# EAGLE design electric-imp-breakout-r1 (EAGLE 5.12)
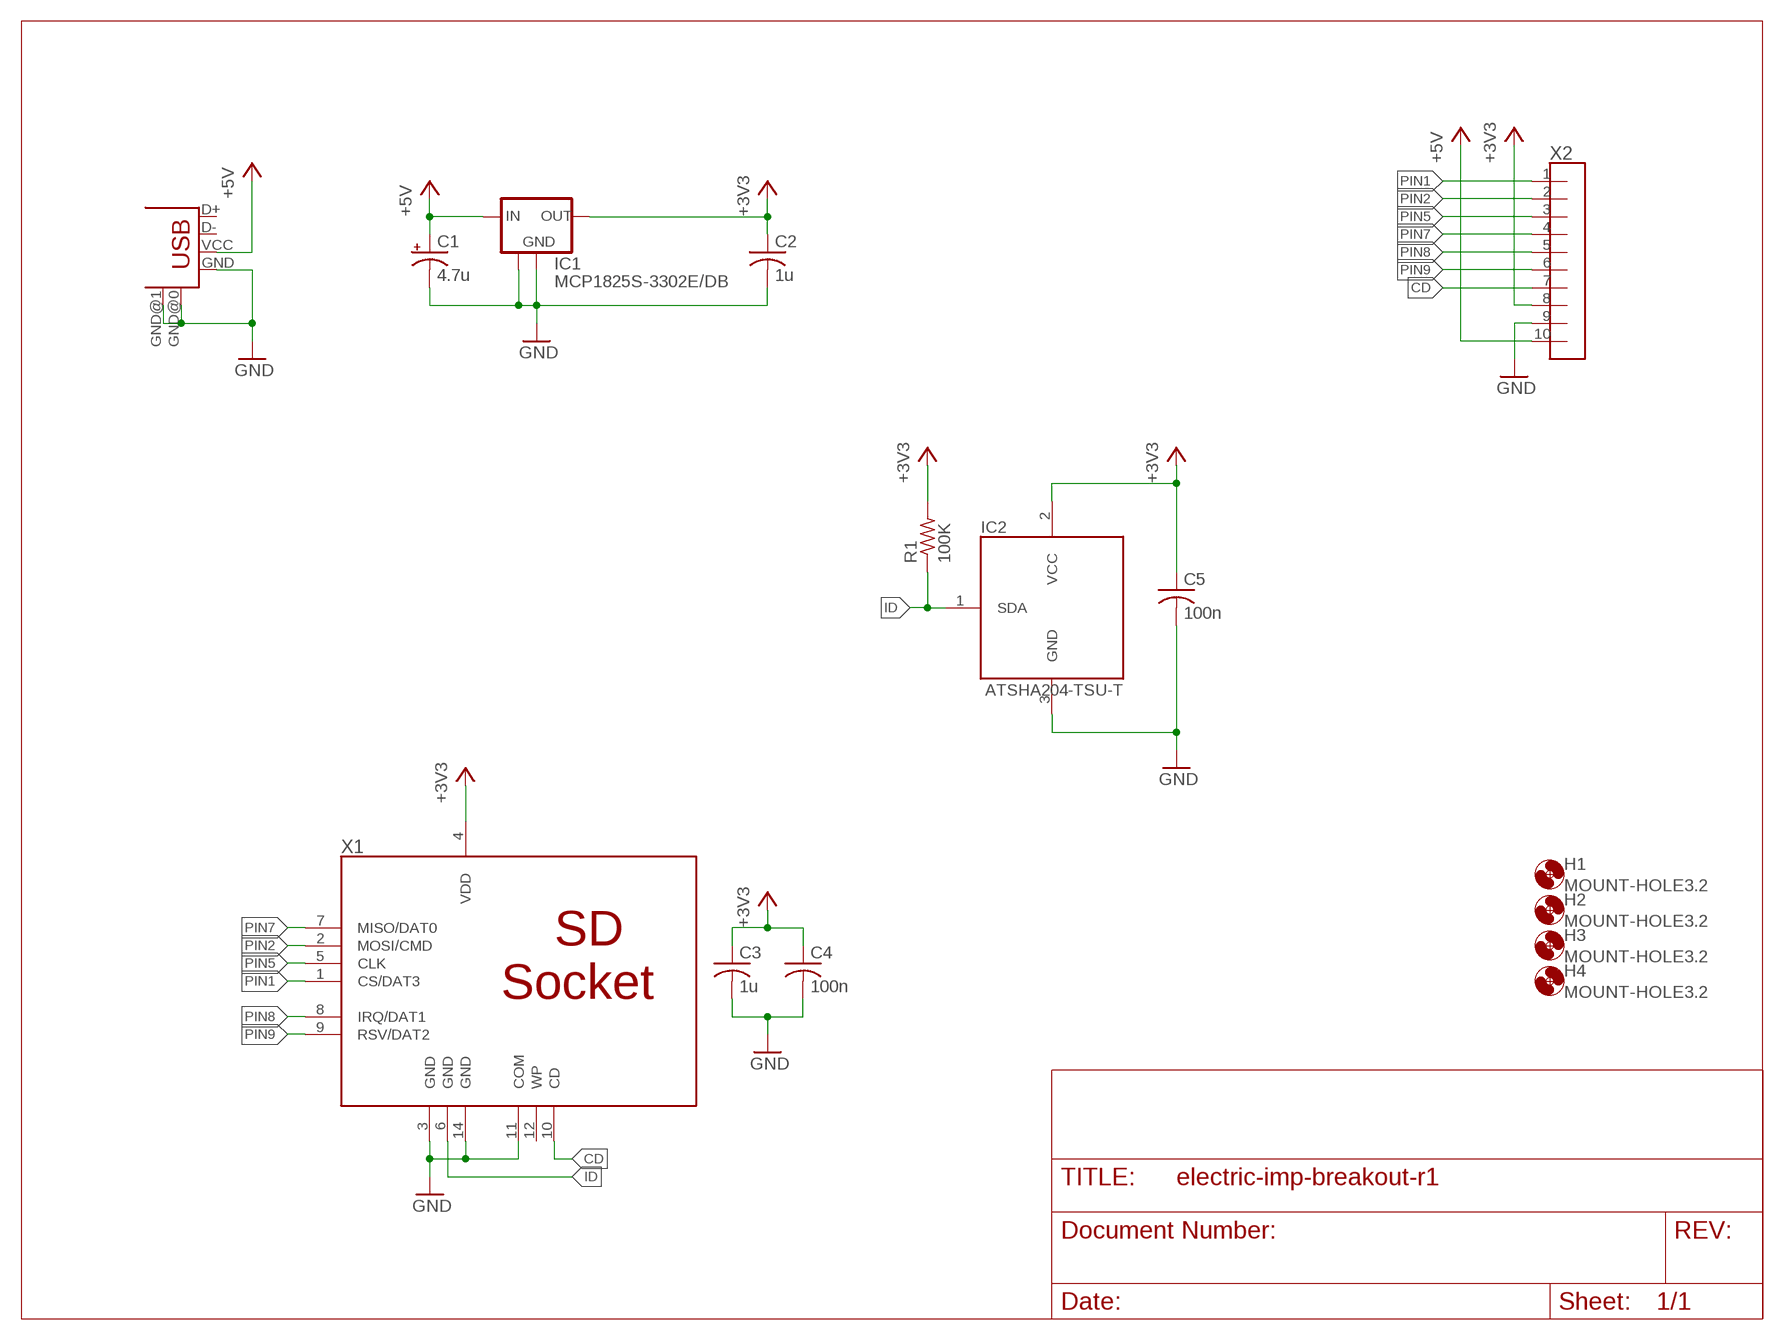
[diagram p0: schematic, sheet 1]

## Parts
C1  4.7u  CPOL-USB  [PANASONIC_B]
C2  1u  C-USC0603  [C0603]
C3  1u  C-USC0603  [C0603]
C4  100n  C-USC0603  [C0603]
C5  100n  C-USC0603  [C0603]
H1  MOUNT-HOLE3.2  [3,2]
H2  MOUNT-HOLE3.2  [3,2]
H3  MOUNT-HOLE3.2  [3,2]
H4  MOUNT-HOLE3.2  [3,2]
IC1  MCP1825S-3302E/DB  [SOT223]
IC2  ATSHA204-TSU-T  [SOT23]
R1  100K  R-US_R0603  [R0603]
USB1  USB-U  [USB-MICROB-ALI]
X1  SCDA1A090X  [SCDA1A090X]
X2  M10-100MIL  [100MIL-10]

## Nets
+3V3: C2.1 C3.1 C4.1 C5.1 IC1.3(OUT) IC2.2(VCC) R1.2 X1.4(VDD) X2.8
+5V: C1.+ IC1.1(IN) USB1.VCC(VBUS) X2.10
CD: X1.10(CD) X2.7
GND: C1.- C2.2 C3.2 C4.2 C5.2 IC1.2(GND) IC1.4(GND1) IC2.3(GND) USB1.GND USB1.GND@0(GND) USB1.GND@1(GND) X1.3(GND) X1.11(COM) X1.14(GND) X2.9
ID: IC2.1(SDA) R1.1 X1.6(GND)
PIN1: X1.1(CS/DAT3) X2.1
PIN2: X1.2(MOSI/CMD) X2.2
PIN5: X1.5(CLK) X2.3
PIN7: X1.7(MISO/DAT0) X2.4
PIN8: X1.8(IRQ/DAT1) X2.5
PIN9: X1.9(RSV/DAT2) X2.6
Unconnected: USB1.D+ USB1.D- X1.12(WP)

## Library data of the parts
C1 = rcl:CPOL-US: POLARIZED CAPACITOR, American symbol
C2-C5 = rcl:C-US: CAPACITOR, American symbol
H1-H4 = holes:MOUNT-HOLE: MOUNTING HOLE with drill center marker
IC1 = rbg-microchip-vreg:MCP1825S-3302E
IC2 = rbg-atmel-cryptoauth:ATSHA204-TSU-T
R1 = rcl:R-US_: RESISTOR, American symbol
USB1 = con-usb-2:USB: USB Connectors
X1 = rbg-alps-sd:SCDA1A090X
X2 = rbg-generic-headers:M10-100MIL

## Board
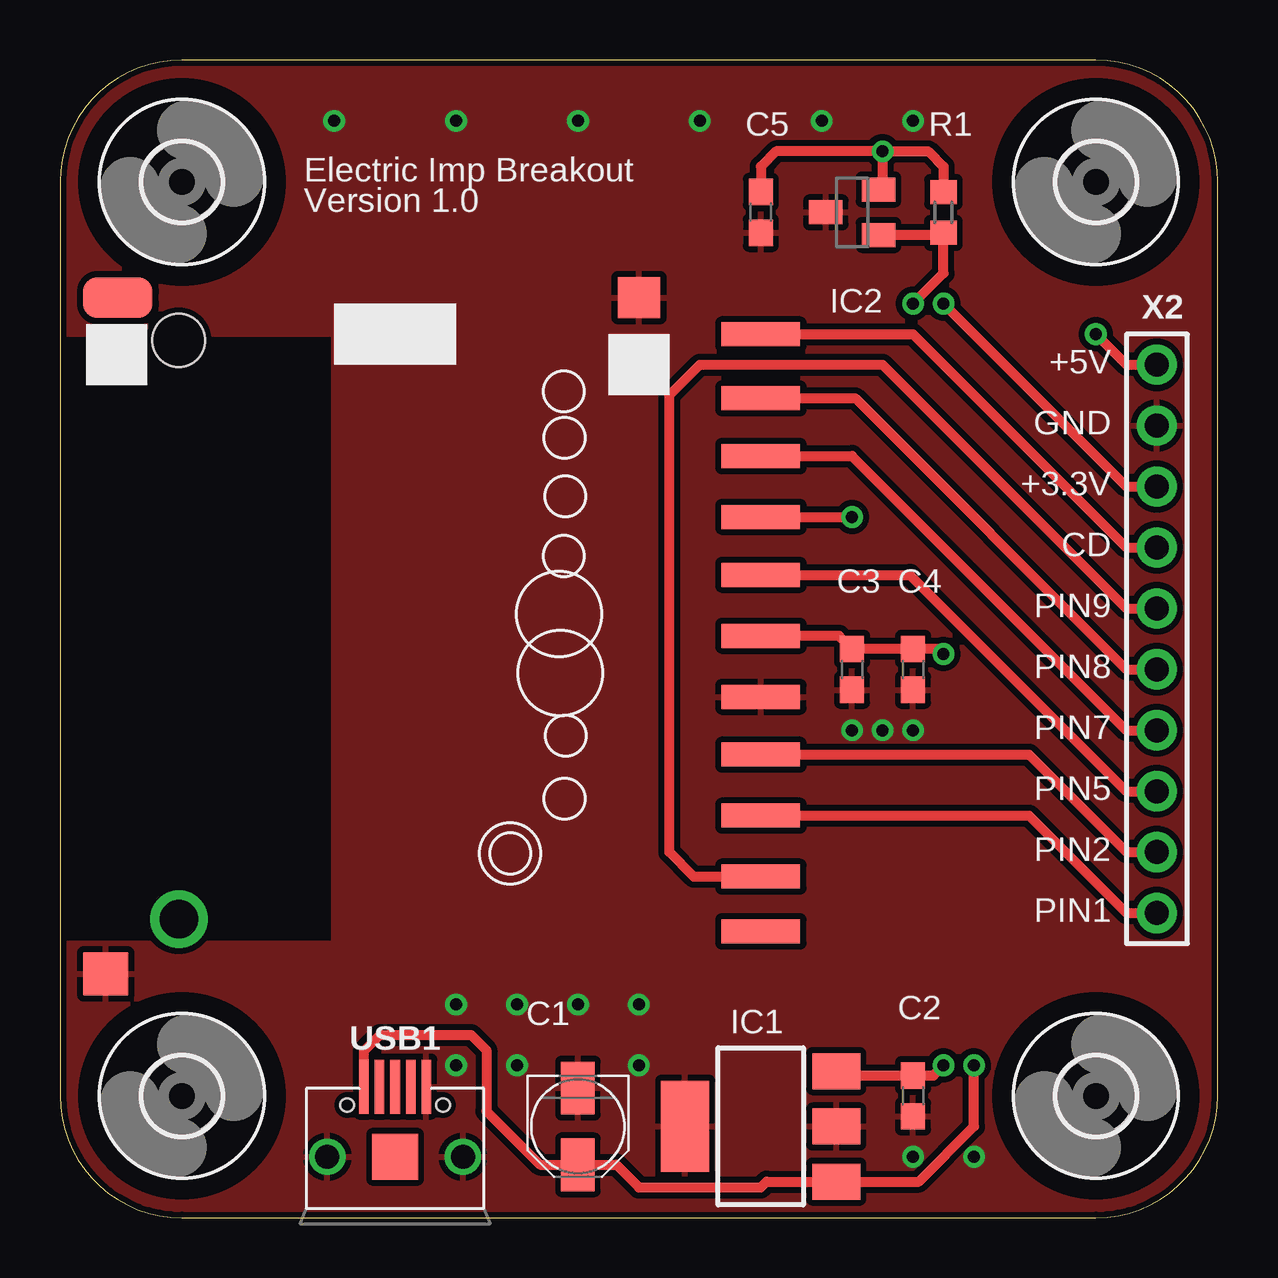
[diagram p1: board, top side]
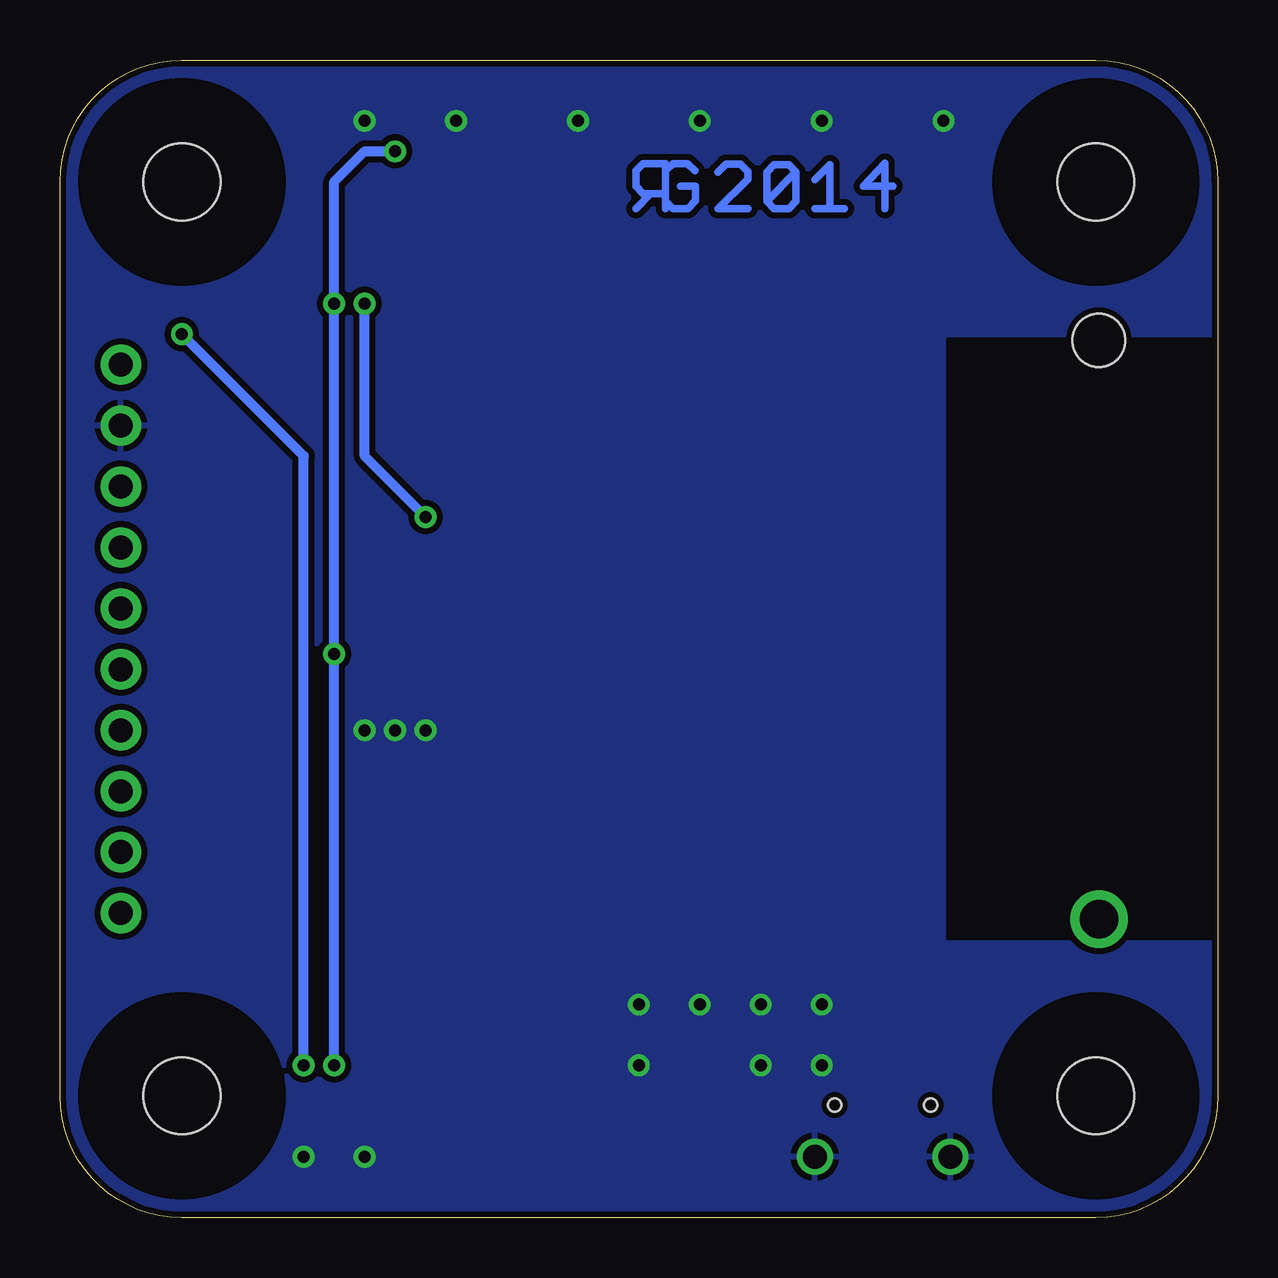
[diagram p2: board, bottom side, seen from below]

Size 48.26 x 48.26 mm. Coordinates in mm from the lower left corner, seen from the top.
Outline: 43.18,0 arc90 48.26,5.08 48.26,43.18 arc90 43.18,48.26 5.08,48.26 arc90 0,43.18 0,5.08 arc90 5.08,0 43.18,0
Copper layers (1*16): Top 0.035mm / dielectric 1.5mm / Bottom 0.035mm
Design rules "default *": minimum track width 10mil, minimum drill 0.5mm, track to track 8mil, track to pad 8mil, pad to pad 8mil, via to via 8mil, smd to smd 8mil, copper to edge 10mil, drill to drill 8mil, minimum pad ring 10mil, minimum via ring 8mil, stop-mask expansion 4mil, vias tented up to drill 20mil, thermal gap 10mil

### Footprints (pad centres in the part's own frame; a part is rotated, then mirrored left to right if it is on the bottom)
PANASONIC_B = smd 2.2 x 1.4: + 1.6,0; - -1.6,0
C0603 = smd 1.1 x 1: 1 -0.85,0; 2 0.85,0
3,2 = hole 3.2: 0,0
SOT223 = smd 1.5 x 2: 1 -2.3,-3.15; 2 0,-3.15; 3 2.3,-3.15 | smd 3.8 x 2: 4 0,3.15
SOT23 = smd 1 x 1.4: 1 -0.95,-1.1; 2 0.95,-1.1; 3 0,1.1
R0603 = smd 1 x 1.1: 1 -0.85,0; 2 0.85,0
USB-MICROB-ALI = smd 0.4 x 2.25: D+ 0,2.925; D- -0.65,2.925; GND 1.3,2.925; ID 0.65,2.925; VCC -1.3,2.925 | drill 1 round: GND@0 -2.825,0; GND@1 2.825,0 | smd 1.9 x 1.9: GND@2 0,0 | hole 0.55: -2,2.15; 2,2.15
SCDA1A090X = smd 0.991 x 3.302: 1 8.636,16.51; 2 6.096,16.51; 3 3.683,16.51; 4 1.143,16.51; 5 -1.397,16.51; 6 -3.81,16.51; 7 -6.35,16.51; 8 -8.763,16.51; 9 11.176,16.51; 10 -11.43,16.51; 13 13.462,16.51 | smd 1.702 x 1.803: 11 -12.954,11.43 | smd 1.702 x 2.896: 12 -12.954,-10.287 | smd 1.803 x 1.905: 14 15.24,-10.795 | drill 1.6 pad 1.676 round: P$16 12.954,-7.747 | hole 2.2: -11.176,-7.747
100MIL-10 = drill 1 pad 1.676 round: 1 -11.43,0; 2 -8.89,0; 3 -6.35,0; 4 -3.81,0; 5 -1.27,0; 6 1.27,0; 7 3.81,0; 8 6.35,0; 9 8.89,0; 10 11.43,0

### Placement (x,y rotation side)
C1  21.59,3.81 270 top
C2  35.56,5.08 270 top
C3  33.02,22.86 270 top
C4  35.56,22.86 270 top
C5  29.21,41.91 270 top
H1  5.08,5.08 0 top
H2  5.08,43.18 0 top
H3  43.18,5.08 0 top
H4  43.18,43.18 0 top
IC1  29.21,3.81 90 top
IC2  33.02,41.91 90 top
R1  36.83,41.91 90 top
U$1  [RGLOGO_SMALL_2014]  22.86,41.91 0 bottom
USB1  13.97,2.54 0 top
X1  12.7,25.4 270 top
X2  45.72,24.13 90 top

### Tracks (layer width: path | path; a pad name or v marks a point on that pad's centre or on a via)
+3V3  (via drill 0.5)
  Top 0.406: X1.4 32.47,24.26 C3.1 C4.1 36.62,23.71 v36.83,23.5 | IC1.3 32.54,5.93 C2.1 36.41,5.93 v36.83,6.35 | v34.29,44.45 36.2,44.45 36.83,43.81 R1.2 | C5.1 29.21,43.81 29.84,44.45 v34.29,44.45 | X2.8 44.45,30.48 v36.83,38.1 | v34.29,44.45 34.29,43.18 34.12,43.18 IC2.2
  Bottom 0.406: v36.83,6.35 v36.83,23.5 v36.83,38.1 36.83,43.18 35.56,44.45 v34.29,44.45
+5V  (via drill 0.5)
  Top 0.406: USB1.VCC 12.67,6.96 13.34,7.62 17.14,7.62 17.78,6.99 17.78,4.45 20.02,2.21 C1.+ 23.19,2.21 24.13,1.27 29.21,1.27 29.45,1.51 IC1.1 35.8,1.51 38.1,3.81 v38.1,6.35 | v43.18,36.83 44.45,35.56 X2.10
  Bottom 0.406: v38.1,6.35 38.1,31.75 v43.18,36.83
CD
  Top 0.406: X1.10 35.56,36.83 44.45,27.94 X2.7
GND  (via drill 0.5)
  other vias: 33.02,20.32 34.29,20.32 35.56,20.32 11.43,45.72 16.51,45.72 21.59,45.72 26.67,45.72 31.75,45.72 35.56,45.72 19.05,6.35 19.05,8.89 16.51,8.89 21.59,8.89 24.13,8.89 24.13,6.35 35.56,2.54 38.1,2.54 16.51,6.35
  pour Top (isolate 0.254): -1.27,49.53 49.53,49.53 49.53,-1.27 -1.27,-1.27 -1.27,11.43 11.43,11.43 11.43,36.83 -1.27,36.83
  pour Bottom (isolate 0.254): -1.27,49.53 49.53,49.53 49.53,-1.27 -1.27,-1.27 -1.27,11.43 11.43,11.43 11.43,36.83 -1.27,36.83
ID  (via drill 0.5)
  Top 0.406: v35.56,38.1 36.83,39.37 R1.1 36.83,40.96 IC2.1 | X1.6 v33.02,29.21
  Bottom 0.406: v35.56,38.1 35.56,31.75 v33.02,29.21
PIN1
  Top 0.406: X1.1 40.39,16.76 44.45,12.7 X2.1
PIN2
  Top 0.406: X1.2 40.39,19.3 44.45,15.24 X2.2
PIN5
  Top 0.406: X1.5 35.43,26.8 44.45,17.78 X2.3
PIN7
  Top 0.406: X1.7 33.02,31.75 44.45,20.32 X2.4
PIN8
  Top 0.406: X1.8 33.15,34.16 44.45,22.86 X2.5
PIN9
  Top 0.406: X1.9 26.42,14.22 25.4,15.24 25.4,34.29 26.67,35.56 34.29,35.56 44.45,25.4 X2.6

### Text on the board
tNames: Electric Imp Breakout | Version 1.0 | +5V | GND | +3.3V | CD | PIN9 | PIN8 | PIN7 | PIN5 | PIN2 | PIN1